# Altium schematic sheet 3V3Secondary.SchDoc
size A; SheetNumber: 3; SheetTotal: 15
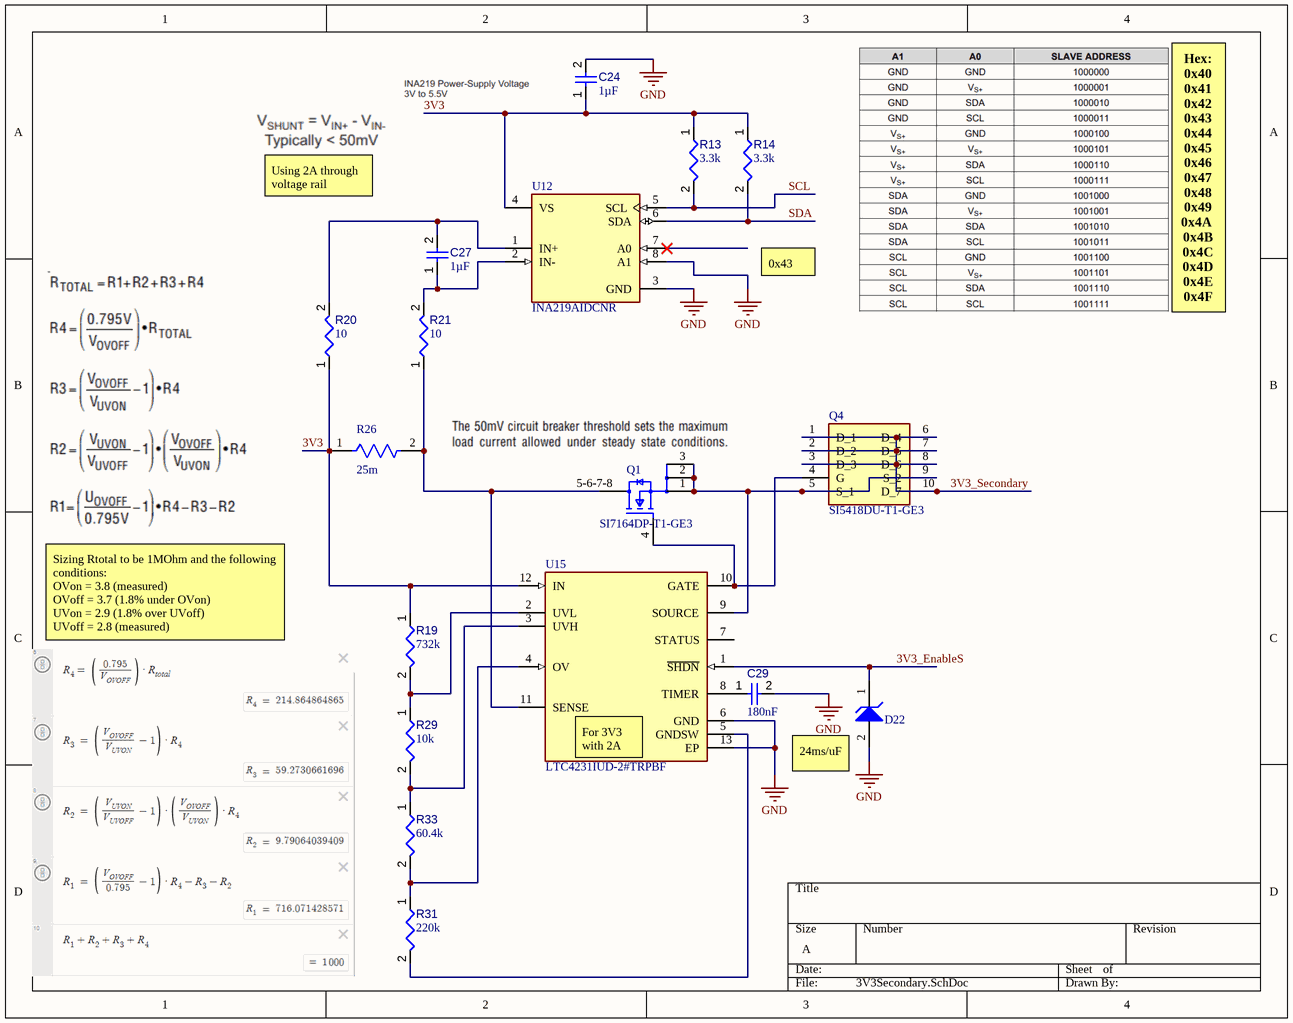
[diagram p0: 3V3Secondary.SchDoc]

## Parts
C24  value 1µF  [CAPC1608X90X35ML15T15]  (hidden comment: Capacitor 1uF +/- 10% 16V 0603)
C27  value 1µF  [CAPC1608X90X40LL10T20]  (hidden comment: Capacitor 1 uF +/- 10% 25 V 0603)
C29  value 180nF  [FP-C0805C-DN-IPC_A]  (hidden comment: C0805C184K5RACTU)
D22  MM3Z3V6T1G  [ONSC-SOD-323-2-477-02_V]  (value not drawn)
Q1  SI7164DP-T1-GE3  [Vishay_S17-0173-SINGLE_MFG]
Q4  SI5418DU-T1-GE3  [SI5418DU-T1-GE3-Footprint-1]
R13  value 3.3k  [FP-CRCW1210-e3-IPC_C]  (hidden comment: CRCW12103K30JNEA)
R14  value 3.3k  [FP-CRCW1210-e3-IPC_C]  (hidden comment: CRCW12103K30JNEA)
R19  value 732k  [FP-CR0805-IPC_A]  (hidden comment: CR0805-FX-7323ELF)
R20  value 10  [RESC0402(1005)_L]  (hidden comment: Resistor 10R  +/-1 % 0402 63 mW)
R21  value 10  [RESC0402(1005)_L]  (hidden comment: Resistor 10R  +/-1 % 0402 63 mW)
R26  Resistance: 25m  [FP-CSR1206-IPC_C]  (hidden comment: CSR1206FK25L0)
R29  value 10k  [RESC1005X40X25ML05T05]  (hidden comment: Resistor 10k +/-1% 0402 100 mW)
R31  value 220k  [FP-ESR01-IPC_C]  (hidden comment: ESR01MZPJ224)
R33  value 60.4k  [RESC1005X40X25NL05T10]  (hidden comment: RC0402FR-0760K4L)
U12  INA219AIDCNR  [FP-DCN0008A-IPC_A]
U15  LTC4231IUD-2#TRPBF  [FP-UD-12-05-08-1855-IPC_A]

## Nets
GND: C24.2 C29.2 D22.2(A) U12.3(GND) U12.8(A1) U15.6(GND) U15.13(EP)
3V3: C24.1 R13.1 R14.1 R19.1 R20.1 R26.1 U12.4(VS) U15.12(IN)
3V3_EnableS: D22.1(K) U15.1(~{SHDN})
3V3_Secondary: Q4.1(D_1) Q4.2(D_2) Q4.3(D_3) Q4.6(D_4) Q4.7(D_5) Q4.8(D_6) Q4.10(D_7)
SCL: R13.2 U12.5(SCL)
SDA: R14.2 U12.6(SDA)
NetC27_1: C27.1 R21.2 U12.2(IN-)
NetC27_2: C27.2 R20.2 U12.1(IN+)
NetC29_1: C29.1 U15.8(TIMER)
NetQ1_1: Q1.1(S) Q1.2(S) Q1.3(S) Q4.5(S_1) Q4.9(S_2) U15.9(SOURCE)
NetQ1_4: Q1.4(G) Q4.4(G) U15.10(GATE)
NetQ1_5-6-7-8: Q1.5-6-7-8(D) R21.1 R26.2 U15.11(SENSE)
NetR19_2: R19.2 R29.1 U15.2(UVL)
NetR29_2: R29.2 R33.1 U15.3(UVH)
NetR31_1: R31.1 R33.2 U15.4(OV)
NetR31_2: R31.2 U15.5(GNDSW)

Not connected (* = marked no-connect by the designer): U12 7(A0)*; U15 7(STATUS)

## Notes on the sheet
- Using 2A through voltage rail
- 0x43
- Hex:
  0x40
  0x41
  0x42
  0x43
  0x44
  0x45
  0x46
  0x47
  0x48
  0x49
  0x4A
  0x4B
  0x4C
  0x4D
  0x4E
  0x4F
- Sizing Rtotal to be 1MOhm and the following conditions:
  OVon = 3.8 (measured)
  OVoff = 3.7 (1.8% under OVon)
  UVon = 2.9 (1.8% over UVoff)
  UVoff = 2.8 (measured)
- (near U15) For 3V3
  with 2A
- (near D22) 24ms/uF

## Library data of the parts
C24 = CMP-001-00004-6: Chip Capacitor, 1 uF, +/- 10%, 16 V, 0603 (1608 Metric); Capacitor Type: Ceramic; Mounting Technology: SM; RoHS Compliant: True; Min Operating Temperature: -55°C; Case/Package: 0603; Pins: 2; Voltage Rating: 16V; Max Operating Temperature: 125°C; Tolerance: 10%
C27 = CMP-001-00005-6: Chip Capacitor, 1 uF, +/- 10%, 25 V, 0603 (1608 Metric); Capacitor Type: Ceramic; Voltage Rating: 25V; Pins: 2; Mounting Technology: SM; RoHS Compliant: True; Max Operating Temperature: 125°C; Case/Package: 0603; Min Operating Temperature: -55°C; Tolerance: 10%
C29 = CMP-001-00086-1: Ceramic Capacitor, Multilayer, Ceramic, 50V, 10% +Tol, 10% -Tol, X7R, 15% TC, 0.18uF, Surface Mount, 0805; Capacitor Type: Ceramic; Mounting Technology: Surface Mount; Pins: 2; Min Operating Temperature: -55°C; Case/Package: 0805; Max Operating Temperature: 125°C; RoHS Compliant: Yes
D22 = CMP-1060-00650-1: Zener Voltage Regulator, 300 mW, 2-Pin SOD-323, Pb-Free, Tape and Reel; Manufacturer: On Semiconductor; VZ Typ (V): 3.6; P Max (W): 0.3; RoHS: Pb-Free; ComponentLink1URL: http://www.onsemi.com/; PackageVersion: Rev. H, 03/2007; PartNumber: MM3Z3V6T1G; ComponentLink2Description: Datasheet; ComponentLink2URL: http://www.onsemi.cn/pub_link/Collateral/MM3Z2V4T1-D.PDF; DatasheetVersion: Rev. 9; PackageReference: SOD-323-2-477-02; ComponentLink3URL: http://www.onsemi.com/pub_link/Collateral/477-02.PDF.1; Packing: Tape and Reel; Mounting Technology: Surface Mount; ComponentLink3Description: Package Specification; PackageDescription: 2-Pin SOD, Body 1.7 x 1.25 mm; ComponentLink1Description: Manufacturer URL
Q1 = CMP-013-00040-1: Power Field-Effect Transistor, 23.5A I(D), 60V, 0.00625ohm, 1-Element, N-Channel, Silicon, Metal-oxide Semiconductor FET; Pins: 5; RoHS Compliant: Yes; Max Operating Temperature: 150°C
Q4 = CMP-013-00041-1: Power Field-Effect Transistor, 11.6A I(D), 30V, 0.0145ohm, 1-Element, N-Channel, Silicon, Metal-oxide Semiconductor FET; Max Operating Temperature: 150°C; RoHS Compliant: Yes; Pins: 3
R13 R14 = CMP-009-00192-1: Fixed Resistor, Metal Glaze/thick Film, 0.5W, 3300ohm, 200V, 5% +/-Tol, 200ppm/Cel, Surface Mount, 1210; Power: 500mW; RoHS Compliant: Yes; Max Operating Temperature: 155°C; Case/Package: 1210; Min Operating Temperature: -55°C; Mounting Technology: Surface Mount; Tolerance: 5%; Pins: 2
R19 = CMP-009-00197-1: Fixed Resistor, Metal Glaze/thick Film, 0.125W, 732000ohm, 150V, 1% +/-Tol, 100ppm/Cel, Surface Mount, 0805; Power: 125mW; Case/Package: 0805; RoHS Compliant: Yes; Min Operating Temperature: -55°C; Max Operating Temperature: 155°C; Mounting Technology: Surface Mount; Pins: 2; Tolerance: 1%
R20 R21 = CMP-009-00152-3: Chip Resistor, 10 Ohms, +/-1 %, 63 mW, -55 to 155 degC, 0402; Tolerance: 1%; Power: 63mW; Pins: 2; Max Operating Temperature: 155°C; Min Operating Temperature: -55°C; Case/Package: 0402
R26 = CMP-26527-000133-1: General Purpose Thick Film Chip Resistor, 1206, 25mΩ, 1%, 0.5W; Max Power Dissipation: 500mW; Temperature Coefficient: 100ppm/°C; Lead Free: Lead Free; Military Standard: Not; Case Code (Imperial): 1206; Max Operating Temperature: 155°C; Case Code (Metric): 3216; Height: 0.026inch; Packaging: Tape and Reel; Case/Package: 1206; Series: CSR; Number of Terminations: 2; RoHS Compliant: Yes; Mount: Surface Mount; Depth: 1.55mm; Contact Plating: Tin; Length: 0.12inch; Radiation Hardening: No; Width: 0.061inch; Size Code: 1206; Power Rating: 500mW; Min Operating Temperature: -55°C; Tolerance: 1%; Resistor Type: Thick Film; Construction: Rectangular
R29 = CMP-009-00015-5: Chip Resistor, 10 KOhm, +/- 1%, 0.1 W, -55 to 155 degC, 0402 (1005 Metric); Voltage Rating: 50V; Power: 100mW; Case/Package: 0402; RoHS Compliant: True; Min Operating Temperature: -55°C; Mounting Technology: SM; Tolerance: 1%; Max Operating Temperature: 155°C; Pins: 2
R31 = CMP-009-00204-1: Fixed Resistor, Metal Glaze/thick Film, 0.2W, 220000ohm, 50V, 5% +/-Tol, 200ppm/Cel, Surface Mount, 0402; Power: 200mW; Max Operating Temperature: 155°C; Tolerance: 5%; RoHS Compliant: Yes; Pins: 2; Mounting Technology: Surface Mount; Case/Package: 0402; Min Operating Temperature: -55°C
R33 = CMP-009-00202-1: Fixed Resistor, Metal Glaze/thick Film, 0.0625W, 60400ohm, 50V, 1% +/-Tol, 100ppm/Cel, Surface Mount, 0402; Power: 62.5mW; Case/Package: 0402; Tolerance: 1%; RoHS Compliant: Yes; Max Operating Temperature: 155°C; Pins: 2; Mounting Technology: Surface Mount; Min Operating Temperature: -55°C
U12 = CMP-010-00025-1: Power Supply Support Circuit, Fixed, 2 Channel, 2V, PDSO8; Nominal Supply Voltage: 3.3V; Max Supply Voltage: 5.5V; Min Supply Voltage: 3V; Case/Package: LSSOP; Max Operating Temperature: 125°C; Min Operating Temperature: -40°C; Pins: 8; RoHS Compliant: Yes
U15 = CMP-019-00049-1: Switching Controller, CMOS, PQCC12; Max Supply Voltage: 36V; Pins: 12; Min Operating Temperature: -40°C; Case/Package: HVQCCN; RoHS Compliant: Yes; Max Operating Temperature: 85°C